# EAGLE schematic GPIO Protector (EAGLE 7.4.0)
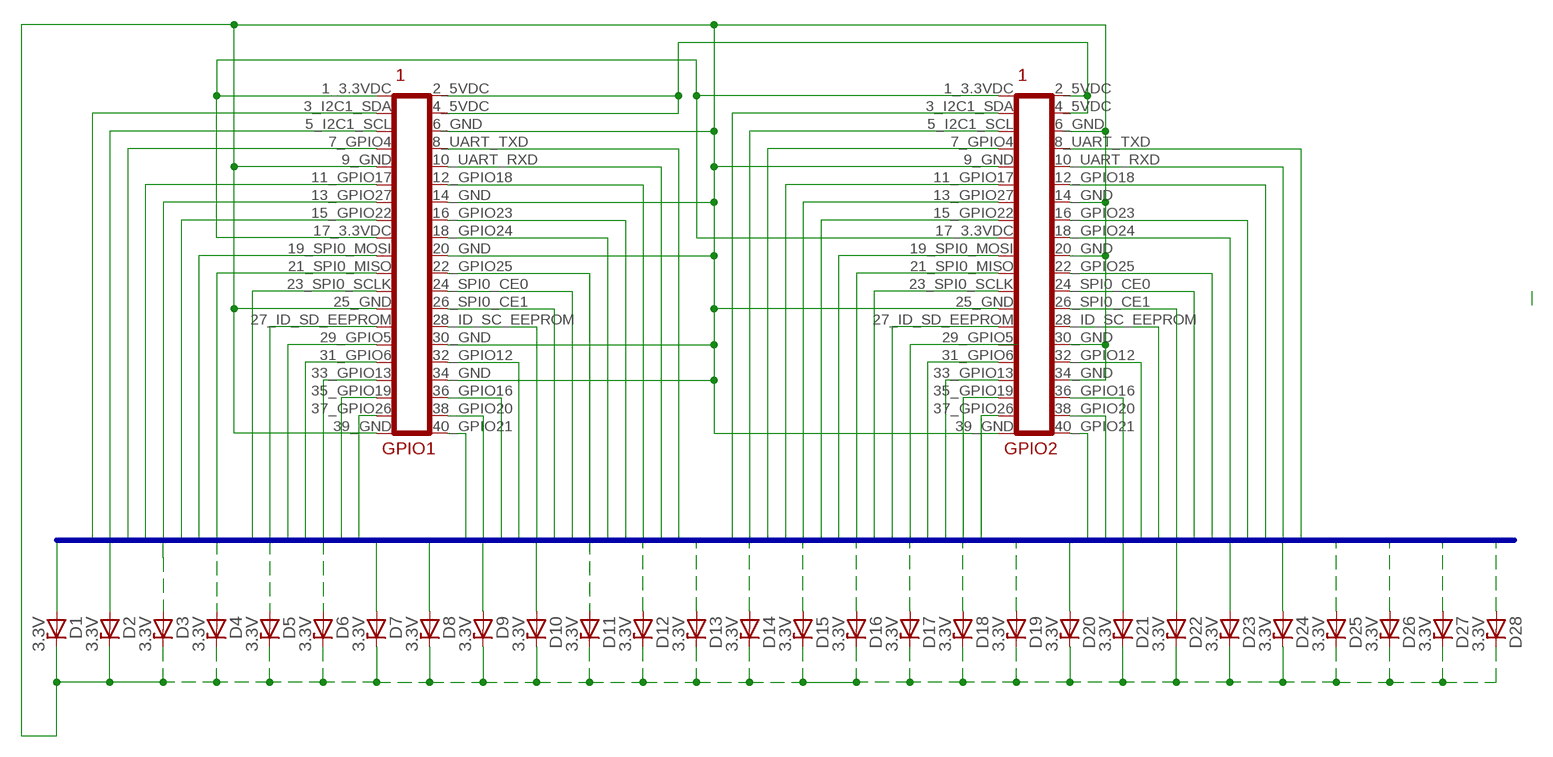
[diagram p0: schematic, sheet 1]

## Parts
D1  3.3V  ZENER-DIODEDO41Z10  [DO41Z10]
D2  3.3V  ZENER-DIODEDO41Z10  [DO41Z10]
D3  3.3V  ZENER-DIODEDO41Z10  [DO41Z10]
D4  3.3V  ZENER-DIODEDO41Z10  [DO41Z10]
D5  3.3V  ZENER-DIODEDO41Z10  [DO41Z10]
D6  3.3V  ZENER-DIODEDO41Z10  [DO41Z10]
D7  3.3V  ZENER-DIODEDO41Z10  [DO41Z10]
D8  3.3V  ZENER-DIODEDO41Z10  [DO41Z10]
D9  3.3V  ZENER-DIODEDO41Z10  [DO41Z10]
D10  3.3V  ZENER-DIODEDO41Z10  [DO41Z10]
D11  3.3V  ZENER-DIODEDO41Z10  [DO41Z10]
D12  3.3V  ZENER-DIODEDO41Z10  [DO41Z10]
D13  3.3V  ZENER-DIODEDO41Z10  [DO41Z10]
D14  3.3V  ZENER-DIODEDO41Z10  [DO41Z10]
D15  3.3V  ZENER-DIODEDO41Z10  [DO41Z10]
D16  3.3V  ZENER-DIODEDO41Z10  [DO41Z10]
D17  3.3V  ZENER-DIODEDO41Z10  [DO41Z10]
D18  3.3V  ZENER-DIODEDO41Z10  [DO41Z10]
D19  3.3V  ZENER-DIODEDO41Z10  [DO41Z10]
D20  3.3V  ZENER-DIODEDO41Z10  [DO41Z10]
D21  3.3V  ZENER-DIODEDO41Z10  [DO41Z10]
D22  3.3V  ZENER-DIODEDO41Z10  [DO41Z10]
D23  3.3V  ZENER-DIODEDO41Z10  [DO41Z10]
D24  3.3V  ZENER-DIODEDO41Z10  [DO41Z10]
D25  3.3V  ZENER-DIODEDO41Z10  [DO41Z10]
D26  3.3V  ZENER-DIODEDO41Z10  [DO41Z10]
D27  3.3V  ZENER-DIODEDO41Z10  [DO41Z10]
D28  3.3V  ZENER-DIODEDO41Z10  [DO41Z10]
GPIO1  RPI_GPIOUPPER  [RPI_GPIO_MALE]
GPIO2  RPI_GPIOUPPER  [RPI_GPIO_MALE]

## Nets
3.3VDC: GPIO1.1_3.3VDC GPIO1.17_3.3VDC GPIO2.1_3.3VDC GPIO2.17_3.3VDC
5VDC: GPIO1.2_5VDC GPIO1.4_5VDC GPIO2.2_5VDC GPIO2.4_5VDC
GND: D1.C D2.C D3.C D4.C D5.C D6.C D7.C D8.C D9.C D10.C D11.C D12.C D13.C D14.C D15.C D16.C D17.C D18.C D19.C D20.C D21.C D22.C D23.C D24.C D25.C D26.C D27.C D28.C GPIO1.6_GND GPIO1.9_GND GPIO1.14_GND GPIO1.20_GND GPIO1.25_GND GPIO1.30_GND GPIO1.34_GND GPIO1.39_GND GPIO2.6_GND GPIO2.9_GND GPIO2.14_GND GPIO2.20_GND GPIO2.25_GND GPIO2.30_GND GPIO2.34_GND GPIO2.39_GND
GPIO4: D3.A GPIO1.7_GPIO4 GPIO2.7_GPIO4
GPIO5: D11.A GPIO1.29_GPIO5
GPIO6: D12.A GPIO1.31_GPIO6 GPIO2.31_GPIO6
GPIO12: D25.A GPIO1.32_GPIO12 GPIO2.32_GPIO12
GPIO13: D13.A GPIO1.33_GPIO13 GPIO2.33_GPIO13
GPIO16: D26.A GPIO1.36_GPIO16 GPIO2.36_GPIO16
GPIO17: D4.A GPIO1.11_GPIO17 GPIO2.11_GPIO17
GPIO18: D16.A GPIO1.12_GPIO18 GPIO2.12_GPIO18
GPIO19: D14.A GPIO1.35_GPIO19 GPIO2.35_GPIO19
GPIO20: D27.A GPIO1.38_GPIO20 GPIO2.38_GPIO20
GPIO21: D28.A GPIO1.40_GPIO21 GPIO2.40_GPIO21
GPIO22: D6.A GPIO1.15_GPIO22 GPIO2.15_GPIO22
GPIO23: D17.A GPIO1.16_GPIO23 GPIO2.16_GPIO23
GPIO24: D18.A GPIO1.18_GPIO24 GPIO2.18_GPIO24
GPIO25: D19.A GPIO1.22_GPIO25 GPIO2.22_GPIO25
GPIO26: D15.A GPIO1.37_GPIO26 GPIO2.37_GPIO26
GPIO27: D5.A GPIO1.13_GPIO27 GPIO2.13_GPIO27
I2C_SCL: D2.A GPIO1.5_I2C1_SCL GPIO2.5_I2C1_SCL
I2C_SDA: D1.A GPIO1.3_I2C1_SDA GPIO2.3_I2C1_SDA
ID_SC: D24.A GPIO1.28_ID_SC_EEPROM GPIO2.28_ID_SC_EEPROM
ID_SD: D10.A GPIO1.27_ID_SD_EEPROM(27_ID_SC_EEPROM) GPIO2.27_ID_SD_EEPROM(27_ID_SC_EEPROM)
SPI_CE0: D22.A GPIO1.24_SPI0_CE0 GPIO2.24_SPI0_CE0
SPI_CE1: D23.A GPIO1.26_SPI0_CE1 GPIO2.26_SPI0_CE1
SPI_MISO: D8.A GPIO1.21_SPI0_MISO GPIO2.21_SPI0_MISO
SPI_MOSI: D7.A GPIO1.19_SPI0_MOSI GPIO2.19_SPI0_MOSI
SPI_SCLK: D9.A GPIO1.23_SPI0_SCLK GPIO2.23_SPI0_SCLK
UART_RXD: D21.A GPIO1.10_UART_RXD(10_UART0_RXD) GPIO2.10_UART_RXD(10_UART0_RXD)
UART_TXD: D20.A GPIO1.8_UART_TXD(8_UART0_TXD) GPIO2.8_UART_TXD(8_UART0_TXD)
Unconnected: GPIO2.29_GPIO5

## Buses
GPIO4,GPIO5,GPIO6,GPIO12,GPIO13,GPIO14,GPIO16,GPIO17,GPIO18,GPIO19,GPIO20,GPIO21,GPIO22,GPIO23,GPIO24,GPIO25,GPIO26,GPIO27,ID_SC,ID_SD,I2C_SCL,I2C_SDA,SPI_CE0,SPI_CE1,SPI_MISO,SPI_MOSI,SPI_SCLK,UART_RXD,UART_TXD

## Library data of the parts
D1-D28 = diode:ZENER-DIODE: Z-Diode
GPIO1 GPIO2 = connectors:RPI_GPIO*: GPIO Connector for Raspberry Pi.